# EAGLE design receiver_mega8 (EAGLE 9.6.2)
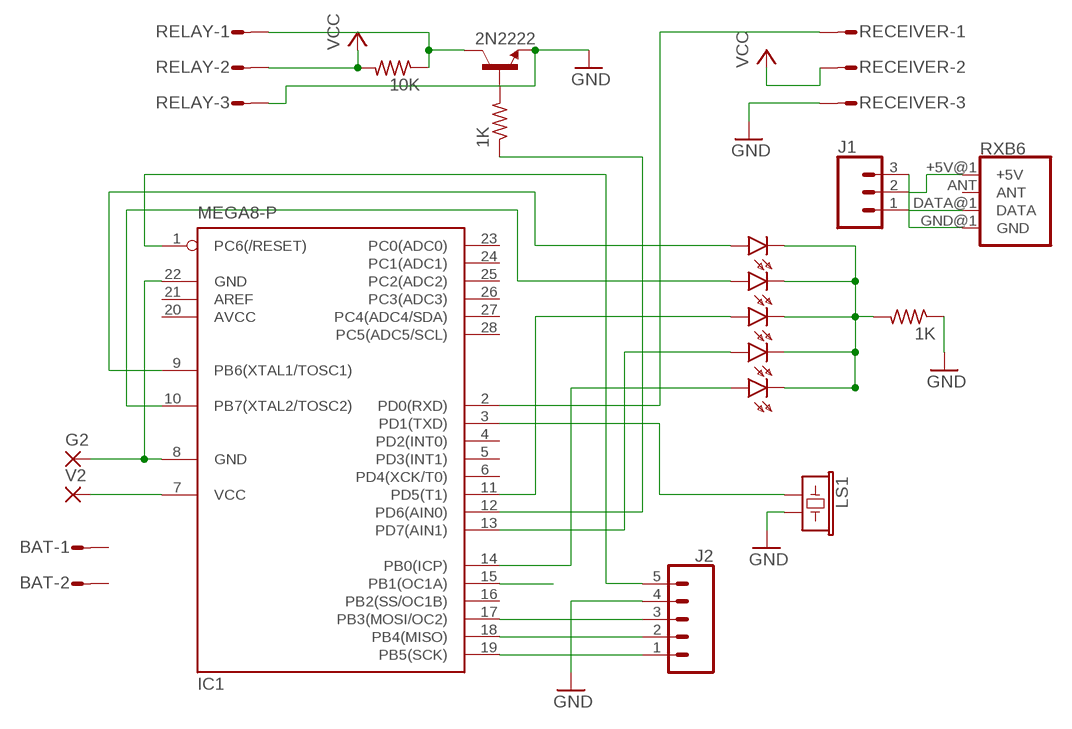
[diagram p0: schematic, sheet 1]

## Parts
BAT  S02P  [S02P]
D2  HLMP6  [HLMP6]
D3  HLMP6  [HLMP6]
D4  HLMP6  [HLMP6]
D5  HLMP6  [HLMP6]
D6  HLMP6  [HLMP6]
G2  1,6/0,8  [1,6/0,8]
IC1  MEGA8-P  [DIL28-3]
J1  CONN_03  [1X03]
J2  CONN_05  [1X05]
LS1  BUZZER-PTH_KIT  [BUZZER-12MM-KIT]
R1  1K  R-US_0207/12  [0207/12]
R2  1K  R-US_0207/12  [0207/12]
R5  10K  R-US_0207/12  [0207/12]
RECEIVER  S03P  [S03P]
RELAY  S03P  [S03P]
RXB6  RF-LINK_RX  [RF-LINK_RX]
T1  2N2222  2N4124-NPN-TO92-CBE  [TO92-CBE]
V2  1,6/0,8  [1,6/0,8]

## Nets
GND: J2.4 LS1.- R2.1 RECEIVER.3 RELAY.3 T1.E
N$1: R1.2 T1.B
N$2: IC1.12(PD6(AIN0)) R1.1
N$3: J1.1 RXB6.DATA@1(DATA)
N$4: IC1.2(PD0(RXD)) RECEIVER.1
N$5: IC1.3(PD1(TXD)) LS1.+
N$6: D2.K D3.K D4.K D5.K D6.K R2.2
N$7: G2.1(P) IC1.8(GND) IC1.22(GND)
N$8: IC1.7(VCC) V2.1(P)
N$9: J1.3 RXB6.GND@1(GND)
N$10: D6.A IC1.9(PB6(XTAL1/TOSC1))
N$11: D5.A IC1.10(PB7(XTAL2/TOSC2))
N$12: D4.A IC1.11(PD5(T1))
N$13: D3.A IC1.13(PD7(AIN1))
N$14: J1.2 RXB6.+5V@1(+5V)
N$15: D2.A IC1.14(PB0(ICP))
N$16: R5.1 RELAY.1 T1.C
N$17: IC1.19(PB5(SCK)) J2.1
N$18: IC1.18(PB4(MISO)) J2.2
N$19: IC1.17(PB3(MOSI/OC2)) J2.3
N$20: IC1.15(PB1(OC1A))
N$22: IC1.1(PC6(/RESET)) J2.5
VCC: R5.2 RECEIVER.2 RELAY.2
Unconnected: BAT.1 BAT.2 IC1.4(PD2(INT0)) IC1.5(PD3(INT1)) IC1.6(PD4(XCK/T0)) IC1.16(PB2(SS/OC1B)) IC1.21(AREF) IC1.23(PC0(ADC0)) IC1.24(PC1(ADC1)) IC1.25(PC2(ADC2)) IC1.26(PC3(ADC3)) IC1.27(PC4(ADC4/SDA)) IC1.28(PC5(ADC5/SCL)) RXB6.ANT

## Power pins joined to a net without a drawn wire
AVCC: IC1.20(AVCC)

## Library data of the parts
BAT = con-amp-mt:S02P: AMP MT CONNECTOR; OC_FARNELL: unknown; OC_NEWARK: unknown
D2-D6 = display-hp:HLMP6: LED 2mm horizontal; MF: AGILENT TECHNOLOGIES; MPN: HLMP-6500; OC_FARNELL: 1652490; OC_NEWARK: 40K0088
G2 V2 = wirepad:1,6/0,8: THROUGH-HOLE PAD
IC1 = atmel:MEGA8-P: MICROCONTROLLER 8 Kbytes FLASH, 1 kbytes SRAM, 512 bytes EEPROM, USART, 4-channel 10 bit ADC, 2-channel 8 bit ADC Pin compatible with Atmega48, ATMega88, ATMega168 Source: avr.lbr; OC_FARNELL: unknown; OC_NEWARK: unknown
J1 = SparkFun-Connectors:CONN_03: Multi connection point. Often used as Generic Header-pin footprint for 0.1 inch spaced/style header connections On any of the 0.1 inch spaced packages, you can populate with these: Break Away Headers - Straight <https://www.sparkfun.com/products/116> (PRT-00116) Break Away Male Headers - Right Angle <https://www.sparkfun.com/products/553> (PRT-00553) Female Headers <https://www.sparkfun.com/products/115> (PRT-00115) Break Away Headers - Machine Pin <https://www.sparkfun.com/products/117> (PRT-00117) Break Away Female Headers - Swiss Machine Pin <https://www.sparkfun.com/products/743> (PRT-00743) Stackable Header - 3 Pin (Female, 0.1") <https://www.sparkfun.com/products/13875> (PRT-13875) For SCREWTERMINALS and SPRING TERMINALS visit here: Screw Terimnals on SparkFun.com <https://www.sparkfun.com/search/results?term=Screw+Terminals> (5mm/3.5mm/2.54mm spacing) This device is also useful as a general connection point to wire up your design to another part of your project. Our various solder wires solder well into these plated through hole pads. Hook-Up Wire - Assortment (Stranded, 22 AWG) <https://www.sparkfun.com/products/11375> (PRT-11375) Hook-Up Wire - Assortment (Solid Core, 22 AWG) <https://www.sparkfun.com/products/11367> (PRT-11367) View the entire wire category on our website here <https://www.sparkfun.com/categories/141> Special notes: Molex polarized connector foot print use with SKU : PRT-08232 with associated crimp pins and housings.; PROD_ID: XXX-00000; VALUE: 455-1750-1-ND
J2 = SparkFun-Connectors:CONN_05: Multi connection point. Often used as Generic Header-pin footprint for 0.1 inch spaced/style header connections On any of the 0.1 inch spaced packages, you can populate with these: Break Away Headers - Straight <https://www.sparkfun.com/products/116> (PRT-00116) Break Away Male Headers - Right Angle <https://www.sparkfun.com/products/553> (PRT-00553) Female Headers <https://www.sparkfun.com/products/115> (PRT-00115) Break Away Headers - Machine Pin <https://www.sparkfun.com/products/117> (PRT-00117) Break Away Female Headers - Swiss Machine Pin <https://www.sparkfun.com/products/743> (PRT-00743) For SCREWTERMINALS and SPRING TERMINALS visit here: Screw Terimnals on SparkFun.com <https://www.sparkfun.com/search/results?term=Screw+Terminals> (5mm/3.5mm/2.54mm spacing) This device is also useful as a general connection point to wire up your design to another part of your project. Our various solder wires solder well into these plated through hole pads. Hook-Up Wire - Assortment (Stranded, 22 AWG) <https://www.sparkfun.com/products/11375> (PRT-11375) Hook-Up Wire - Assortment (Solid Core, 22 AWG) <https://www.sparkfun.com/products/11367> (PRT-11367) View the entire wire category on our website here <https://www.sparkfun.com/categories/141> Special notes: Molex polarized connector foot print use with SKU : PRT-08231 with associated crimp pins and housings. 1MM SMD Version SKU: PRT-10208
LS1 = SparkFun-Electromechanical:BUZZER: Buzzer Small round buzzers that operate around the audible 2kHz range. You can use these as speakers to create simple music or user interfaces. Variant Overview: PTH - Mini Speaker - PC Mount 12mm 2.048kHz <https://www.sparkfun.com/products/7950> PTH_KIT - Mini Speaker - PC Mount 12mm 2.048kHz <https://www.sparkfun.com/products/7950> KIT simplifies soldering by adding stop mask to one side of the pads. PTH_NO_SILK - Mini Speaker - PC Mount 12mm 2.048kHz <https://www.sparkfun.com/products/7950> No silkscreen indicator of buzzer outline. PTH_KIT_NO_SILK - Mini Speaker - PC Mount 12mm 2.048kHz <https://www.sparkfun.com/products/7950> KIT package w/o silkscreen SMD - Buzzer Audio Magnetic (CCV-084B16) SMD buzzer used on, e.g. the LilyPad Buzzer <https://www.sparkfun.com/products/8463> and RFID USB Reader <https://www.sparkfun.com/products/9963>. SMD_KIT - Buzzer Audio Magnetic (CCV-084B16) SMD Buzzer with elongated pins to make soldering easier. Used on the SparkFun Simon Says - Surface Mount Soldering Kit <https://www.sparkfun.com/products/10935>. SMD-SQUARE - Buzzer Audio Magnetic (COMP-15701) SMT square buzzer with one chamfered corner.; PROD_ID: COMP-08253; SF_SKU: COM-07950
R1 R2 R5 = rcl:R-US_: RESISTOR, American symbol; SPICEPREFIX: R
RECEIVER RELAY = con-amp-mt:S03P: AMP MT CONNECTOR; OC_FARNELL: unknown; OC_NEWARK: unknown
RXB6 = SparkFun-RF:RF-LINK_RX: RF Link Receiver (434 MHz, 315 MHz) These wireless receivers work with equivalent transmitters. They can easily fit into a breadboard and work well with microcontrollers to create a very simple wireless data link. Since these are only receivers, they will only work communicating data one-way, you would need two pairs (of different frequencies) to act as a transmitter/receiver pair.. SparkFun Products RF Link Receiver - 4800bps (434 MHz) <https://www.sparkfun.com/products/10532>(WRL-10532); SF_ID: WRL-10533
T1 = transistor:*-NPN-: NPN Transistror BF959 corrected 2008.03.06

## Board
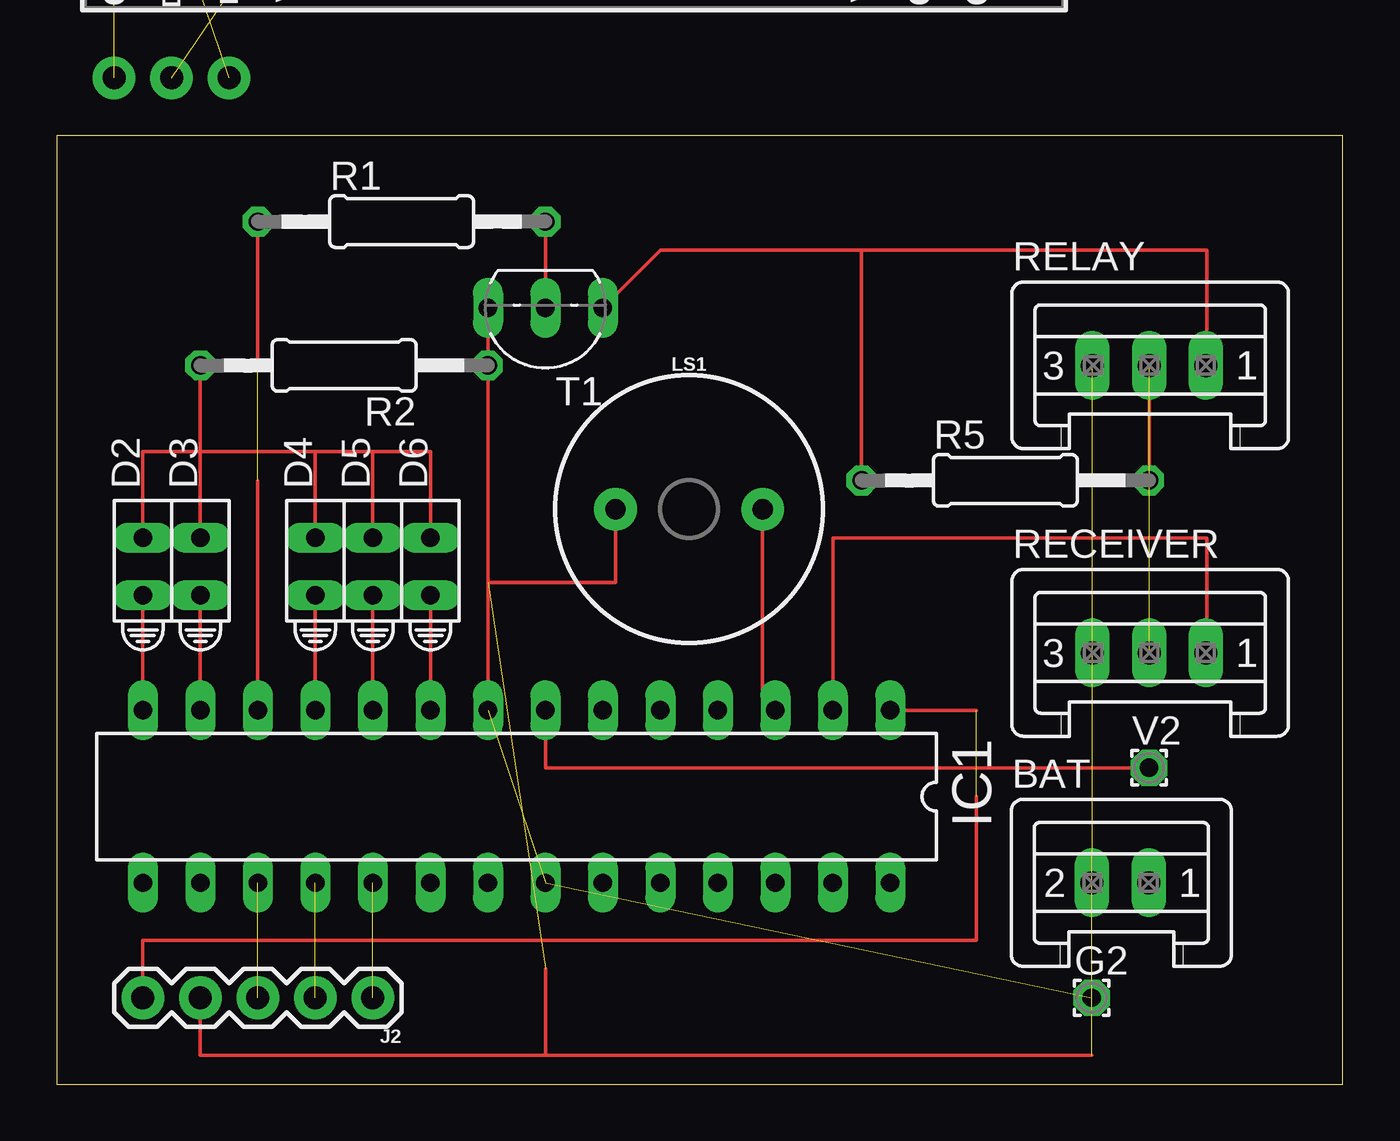
[diagram p1: board, top side]
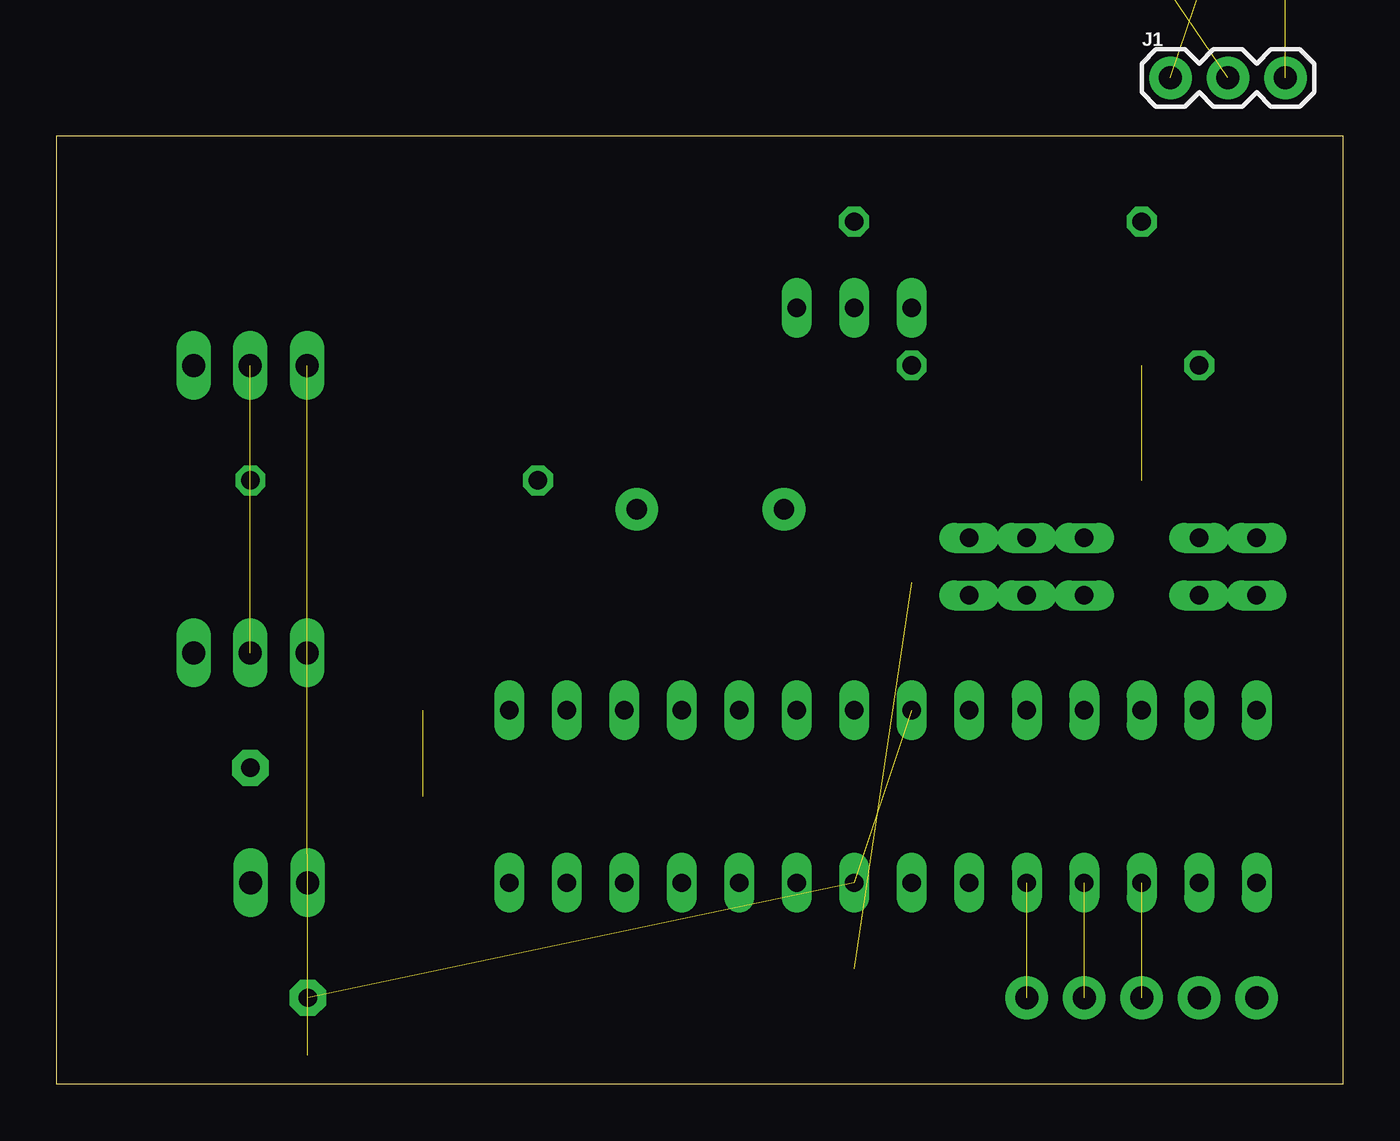
[diagram p2: board, bottom side, seen from below]

Size 56.82 x 41.9 mm. Coordinates in mm from the lower left corner, seen from the top.
Outline: 0,0 56.82,0 56.82,41.9 0,41.9 0,0
Copper layers (1*16): Top 0.035mm / dielectric 1.5mm / Bottom 0.035mm
Design rules "default": minimum track width 6mil, minimum drill 0.35mm, track to track 6mil, track to pad 6mil, pad to pad 6mil, via to via 6mil, smd to smd 6mil, copper to edge 40mil, drill to drill 6mil, minimum pad ring 10mil, minimum via ring 8mil, stop-mask expansion 4mil, vias tented up to drill 0mil, thermal gap 10mil

### Footprints (pad centres in the part's own frame; a part is rotated, then mirrored left to right if it is on the bottom)
S02P = drill 1.016 long: 1 1.25,0; 2 -1.25,0
HLMP6 = drill 0.813 long: A -1.27,0; K 1.27,0
1,6/0,8 = drill 0.813 pad 1.6 octagon: 1 0,0
DIL28-3 = drill 0.813 long: 1 -16.51,-3.81; 2 -13.97,-3.81; 3 -11.43,-3.81; 4 -8.89,-3.81; 5 -6.35,-3.81; 6 -3.81,-3.81; 7 -1.27,-3.81; 8 1.27,-3.81; 9 3.81,-3.81; 10 6.35,-3.81; 11 8.89,-3.81; 12 11.43,-3.81; 13 13.97,-3.81; 14 16.51,-3.81; 15 16.51,3.81; 16 13.97,3.81; 17 11.43,3.81; 18 8.89,3.81; 19 6.35,3.81; 20 3.81,3.81; 21 1.27,3.81; 22 -1.27,3.81; 23 -3.81,3.81; 24 -6.35,3.81; 25 -8.89,3.81; 26 -11.43,3.81; 27 -13.97,3.81; 28 -16.51,3.81
1X03 = drill 1.016 pad 1.88: 1 0,0; 2 2.54,0; 3 5.08,0
1X05 = drill 1.016 pad 1.88: 1 0,0; 2 2.54,0; 3 5.08,0; 4 7.62,0; 5 10.16,0
BUZZER-12MM-KIT = drill 0.9 pad 1.88: + 3.25,0; - -3.25,0
0207/12 = drill 0.813 octagon: 1 -6.35,0; 2 6.35,0
S03P = drill 1.016 long: 1 2.5,0; 2 0,0; 3 -2.5,0
RF-LINK_RX = drill 1.016 pad 1.88: +5V@1 -12.7,-0.127; +5V@2 12.7,0.127; ANT 20.32,-0.127; DATA@1 -17.78,-0.127; DATA@2 -15.24,0.127; GND@2 15.24,-0.127; GND@3 17.78,0.127 | drill 1.016 pad 1.88 square: GND@1 -20.32,0.127
TO92-CBE = drill 0.813 long: B 0,0; C -2.54,0; E 2.54,0

### Placement (x,y rotation side)
BAT  46.99,8.89 0 top
D2  3.81,22.86 90 top
D3  6.35,22.86 90 top
D4  11.43,22.86 90 top
D5  13.97,22.86 90 top
D6  16.51,22.86 90 top
G2  45.72,3.81 0 top
IC1  20.32,12.7 180 top
J1  7.62,44.45 0 bottom
J2  13.97,3.81 180 top
LS1  27.94,25.4 0 top
R1  15.24,38.1 0 top
R2  12.7,31.75 180 top
R5  41.91,26.67 0 top
RECEIVER  48.26,19.05 0 top
RELAY  48.26,31.75 0 top
RXB6  22.86,52.07 0 top  (outside the outline)
T1  21.59,34.29 180 top
V2  48.26,13.97 0 top

### Tracks (layer width: path | path; a pad name or v marks a point on that pad's centre or on a via)
GND  (3 unrouted)
  Top 0.152: LS1.- 24.69,25.96 | LS1.- 24.18,25.4 | 19.05,16.51 19.05,22.15 | 19.05,22.15 R2.1 T1.E | LS1.- 24.69,22.15 19.05,22.15 | J2.4 6.35,1.27 21.59,1.27 | 21.59,1.27 45.72,1.27 | 21.59,1.27 21.59,5.08
N$1
  Top 0.152: T1.B R1.2
N$2  (1 unrouted)
  Top 0.152: IC1.12 8.89,26.67 | R1.1 8.89,31.75
N$3  (1 unrouted)
N$4
  Top 0.152: IC1.2 34.29,24.13 50.8,24.13 50.8,19.09 RECEIVER.1
N$5
  Top 0.152: IC1.3 31.19,17.07 LS1.+
N$6
  Top 0.152: D2.K 3.81,27.94 6.35,27.94 | D6.K 16.51,27.94 13.97,27.94 | 6.35,27.94 11.43,27.94 | 11.43,27.94 13.97,27.94 | D5.K 13.97,27.94 | D4.K 11.43,27.94 | D3.K 6.35,26.42 | 6.35,26.42 R2.2 | 6.35,26.42 6.35,27.94
N$7  (2 unrouted)
N$8
  Top 0.152: IC1.7 21.59,13.97 V2.1
N$9  (1 unrouted)
N$10
  Top 0.152: IC1.9 D6.A
N$11
  Top 0.152: IC1.10 D5.A
N$12
  Top 0.152: IC1.11 D4.A
N$13
  Top 0.152: IC1.13 D3.A
N$14  (1 unrouted)
N$15
  Top 0.152: IC1.14 D2.A
N$16
  Top 0.152: R5.1 35.56,36.83 | 35.56,36.83 50.8,36.83 50.8,31.79 RELAY.1 | T1.C 26.67,36.83 35.56,36.83
N$17  (1 unrouted)
N$18  (1 unrouted)
N$19  (1 unrouted)
N$22  (1 unrouted)
  Top 0.152: J2.5 3.81,6.35 40.64,6.35 40.64,12.7 | IC1.1 40.64,16.51
VCC  (1 unrouted)
  Top 0.152: RELAY.2 R5.2